# Altium schematic sheet LED原理图.SchDoc
size A4
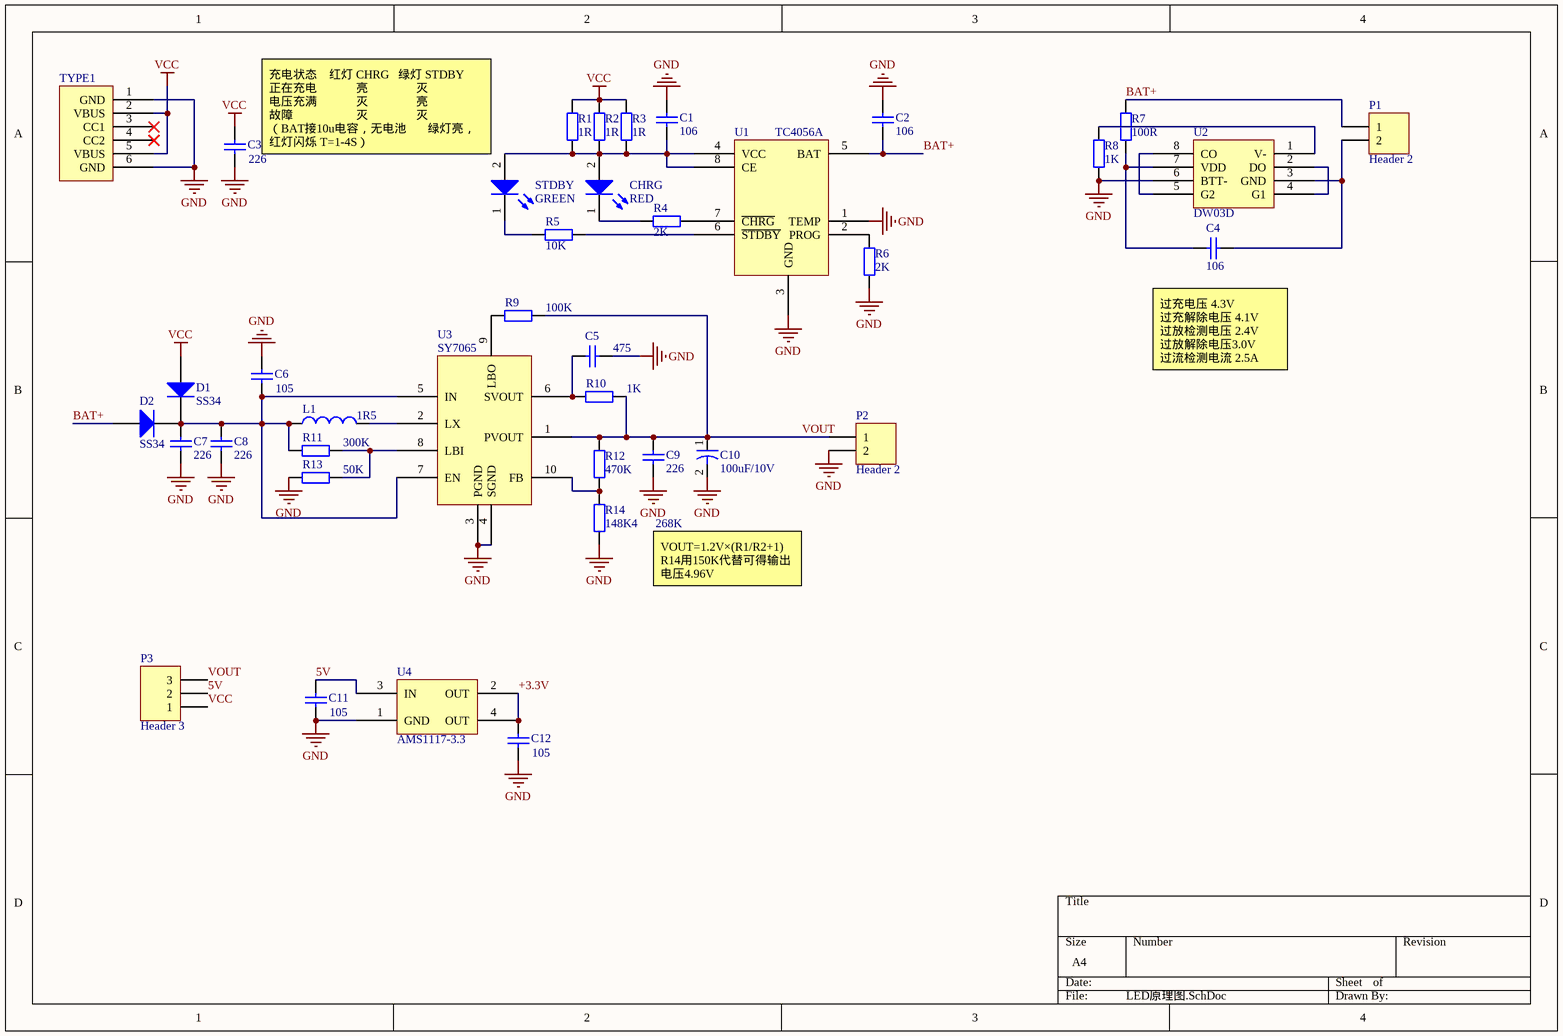
[diagram p0: LED原理图.SchDoc]

## Parts
C1  value 106  [0805C]  (hidden comment: Cap)
C2  value 106  [0805C]  (hidden comment: Cap)
C3  value 226  [0805C]  (hidden comment: Cap)
C4  value 106  [0805C]  (hidden comment: Cap)
C5  value 475  [0805C]  (hidden comment: Cap)
C6  value 105  [0805C]  (hidden comment: Cap)
C7  value 226  [0805C]  (hidden comment: Cap)
C8  value 226  [0805C]  (hidden comment: Cap)
C9  value 226  [0805C]  (hidden comment: Cap)
C10  value 100uF/10V  [C1206]  (hidden comment: Cap2)
C11  value 105  [0805C]  (hidden comment: Cap)
C12  value 105  [0805C]  (hidden comment: Cap)
CHRG  RED  [LED-0805]
D1  SS34  [LC-SMA(DO-214AC)_S2]
D2  SS34  [LC-SMA(DO-214AC)_S2]
L1  value 1R5  [电感SMD]  (hidden comment: Inductor)
P1  Header 2  [XH2.54-2]
P2  Header 2  [XH2.54-2]
P3  Header 3  [XH2.54-3]
R1  value 1R  [0805R]  (hidden comment: Res2)
R2  value 1R  [0805R]  (hidden comment: Res2)
R3  value 1R  [0805R]  (hidden comment: Res2)
R4  value 2K  [0805R]  (hidden comment: Res2)
R5  value 10K  [0805R]  (hidden comment: Res2)
R6  value 2K  [0805R]  (hidden comment: Res2)
R7  value 100R  [0805R]  (hidden comment: Res2)
R8  value 1K  [0805R]  (hidden comment: Res2)
R9  value 100K  [0805R]  (hidden comment: Res2)
R10  value 1K  [0805R]  (hidden comment: Res2)
R11  value 300K  [0805R]  (hidden comment: Res2)
R12  value 470K  [0805R]  (hidden comment: Res2)
R13  value 50K  [0805R]  (hidden comment: Res2)
R14  value 148K4      268K  [0805R]  (hidden comment: Res2)
STDBY  GREEN  [LED-0805]
TYPE1  TYPE-CF-6P-RAT-L6.8W  [TYPE-CF-6P-RAT-L6.8W]  (value not drawn)
U1  TC4056A  [SOP-8]
U2  DW03D  [LC-TSSOP-8_3x4.4x065P]
U3  SY7065  [QFN2*2-10]
U4  AMS1117-3.3  [SOT-233]

## Nets
GND: C1.2 C2.2 C3.1 C5.1 C6.2 C7.1 C8.1 C9.2 C10.2 C11.1 C12.1 P2.2 R6.1 R8.2 R13.1 R14.1 TYPE1.1(GND) TYPE1.6(GND) U1.1(TEMP) U1.3(GND) U2.6(BTT-) U3.3(PGND) U3.4(SGND) U4.1(GND)
VCC: C3.2 D1.1(A) P3.1 R1.1 R2.1 R3.1 TYPE1.2(VBUS) TYPE1.5(VBUS)
5V: C11.2 P3.2 U4.3(IN)
+3.3V: C12.2 U4.2(OUT) U4.4(OUT)
BAT+: C2.1 D2.1(A) P1.1 R7.1 U1.5(BAT)
VOUT: C9.1 C10.1 P2.1 P3.3 R9.2 R10.2 R12.2 U3.1(PVOUT)
NetC1_1: C1.1 CHRG.2(A) R1.2 R2.2 R3.2 STDBY.2(A) U1.4(VCC) U1.8(CE)
NetC4_1: C4.1 P1.2 U2.3(GND)
NetC4_2: C4.2 R7.2 U2.7(VDD)
NetC5_2: C5.2 R10.1 U3.6(SVOUT)
NetC6_1: C6.1 C7.2 C8.2 D1.2(K) D2.2(K) L1.1 R11.1 U3.5(IN) U3.7(EN)
NetCHRG_1: CHRG.1(K) R4.1
NetL1_2: L1.2 U3.2(LX)
NetR4_2: R4.2 U1.7(~{CHRG})
NetR5_1: R5.1 STDBY.1(K)
NetR5_2: R5.2 U1.6(~{STDBY})
NetR6_2: R6.2 U1.2(PROG)
NetR8_1: R8.1 U2.1(V-)
NetR9_1: R9.1 U3.9(LBO)
NetR11_2: R11.2 R13.2 U3.8(LBI)
NetR12_1: R12.1 R14.2 U3.10(FB)
NetU2_2: U2.2(DO) U2.4(G1)
NetU2_5: U2.5(G2) U2.8(CO)

Not connected (* = marked no-connect by the designer): TYPE1 3(CC1)* 4(CC2)*

## Notes on the sheet
- 充电状态    红灯 CHRG   绿灯 STDBY
  正在充电             亮                灭
  电压充满             灭                亮
  故障                     灭                灭
  （BAT接10u电容，无电池       绿灯亮，红灯闪烁 T=1-4S）
- (near C4) 过充电压 4.3V
  过充解除电压 4.1V
  过放检测电压 2.4V
  过放解除电压3.0V
  过流检测电流 2.5A
- VOUT=1.2V×(R1/R2+1)
  R14用150K代替可得输出电压4.96V

## Library data of the parts
C1-C9 C11 C12 = Cap: Capacitor; Published: 8-Jun-2000; LatestRevisionDate: 17-Jul-2002; LatestRevisionNote: Re-released for DXP Platform.; PackageReference: RAD-0.3; Publisher: Altium Limited; PackageDescription: Radial Cap, Thru-Hole; 2 Leads; 0.3 in Pin Spacing
C10 = Cap2: Capacitor; Published: 23-Sep-2002; PackageReference: CAPR5-4X5; Publisher: Altium Limited; PackageDescription: Capacitor; 2 Leads
CHRG STDBY = LED0: Typical INFRARED GaAs LED; Published: 8-Jun-2000; LatestRevisionDate: 08-Jul-2005; LatestRevisionNote: Mech Layer 1 removed.; PackageReference: LED-0; Publisher: Altium Limited; PackageDescription: LED; 2 Leads
D1 D2 = Diode: Default Diode; Published: 8-Jun-2000; LatestRevisionDate: 17-Jul-2002; LatestRevisionNote: Re-released for DXP Platform.; PackageVersion: Sep-1996; PackageReference: SMC; Publisher: Altium Limited; PackageDescription: DO-214-AB/SMC; 2 C-Bend Leads; Body 7.9 x 5.9 mm, inc. leads (LxW); Code_JEDEC: DO-214-AB
L1 = Inductor: Code_IEC: 1005; Published: 8-Jun-2000; LatestRevisionDate: 29-May-2009; LatestRevisionNote: IPC-7351 Footprint Added.; PackageReference: 0402-A; Publisher: Altium Limited; PackageDescription: Chip Inductor; Code_JEITA: 0402
P1 P2 = Header 2: Header, 2-Pin; LatestRevisionDate: 17-Jul-2002; LatestRevisionNote: Re-released for DXP Platform.; Publisher: Altium Limited
P3 = Header 3: Header, 3-Pin; LatestRevisionDate: 17-Jul-2002; LatestRevisionNote: Re-released for DXP Platform.; Publisher: Altium Limited
R1-R14 = Res2: Resistor; Published: 8-Jun-2000; LatestRevisionDate: 17-Jul-2002; LatestRevisionNote: Re-released for DXP Platform.; PackageReference: AXIAL-0.4; Publisher: Altium Limited; PackageDescription: Axial Device, Thru-Hole; 2 Leads; 0.4 in Pin Spacing